# Altium schematic sheet ESP12.SchDoc: *ProgV1.2
size 400 x 200 mm; DrawnBy: *Ankul Baghel; SheetNumber: 1; SheetTotal: 1
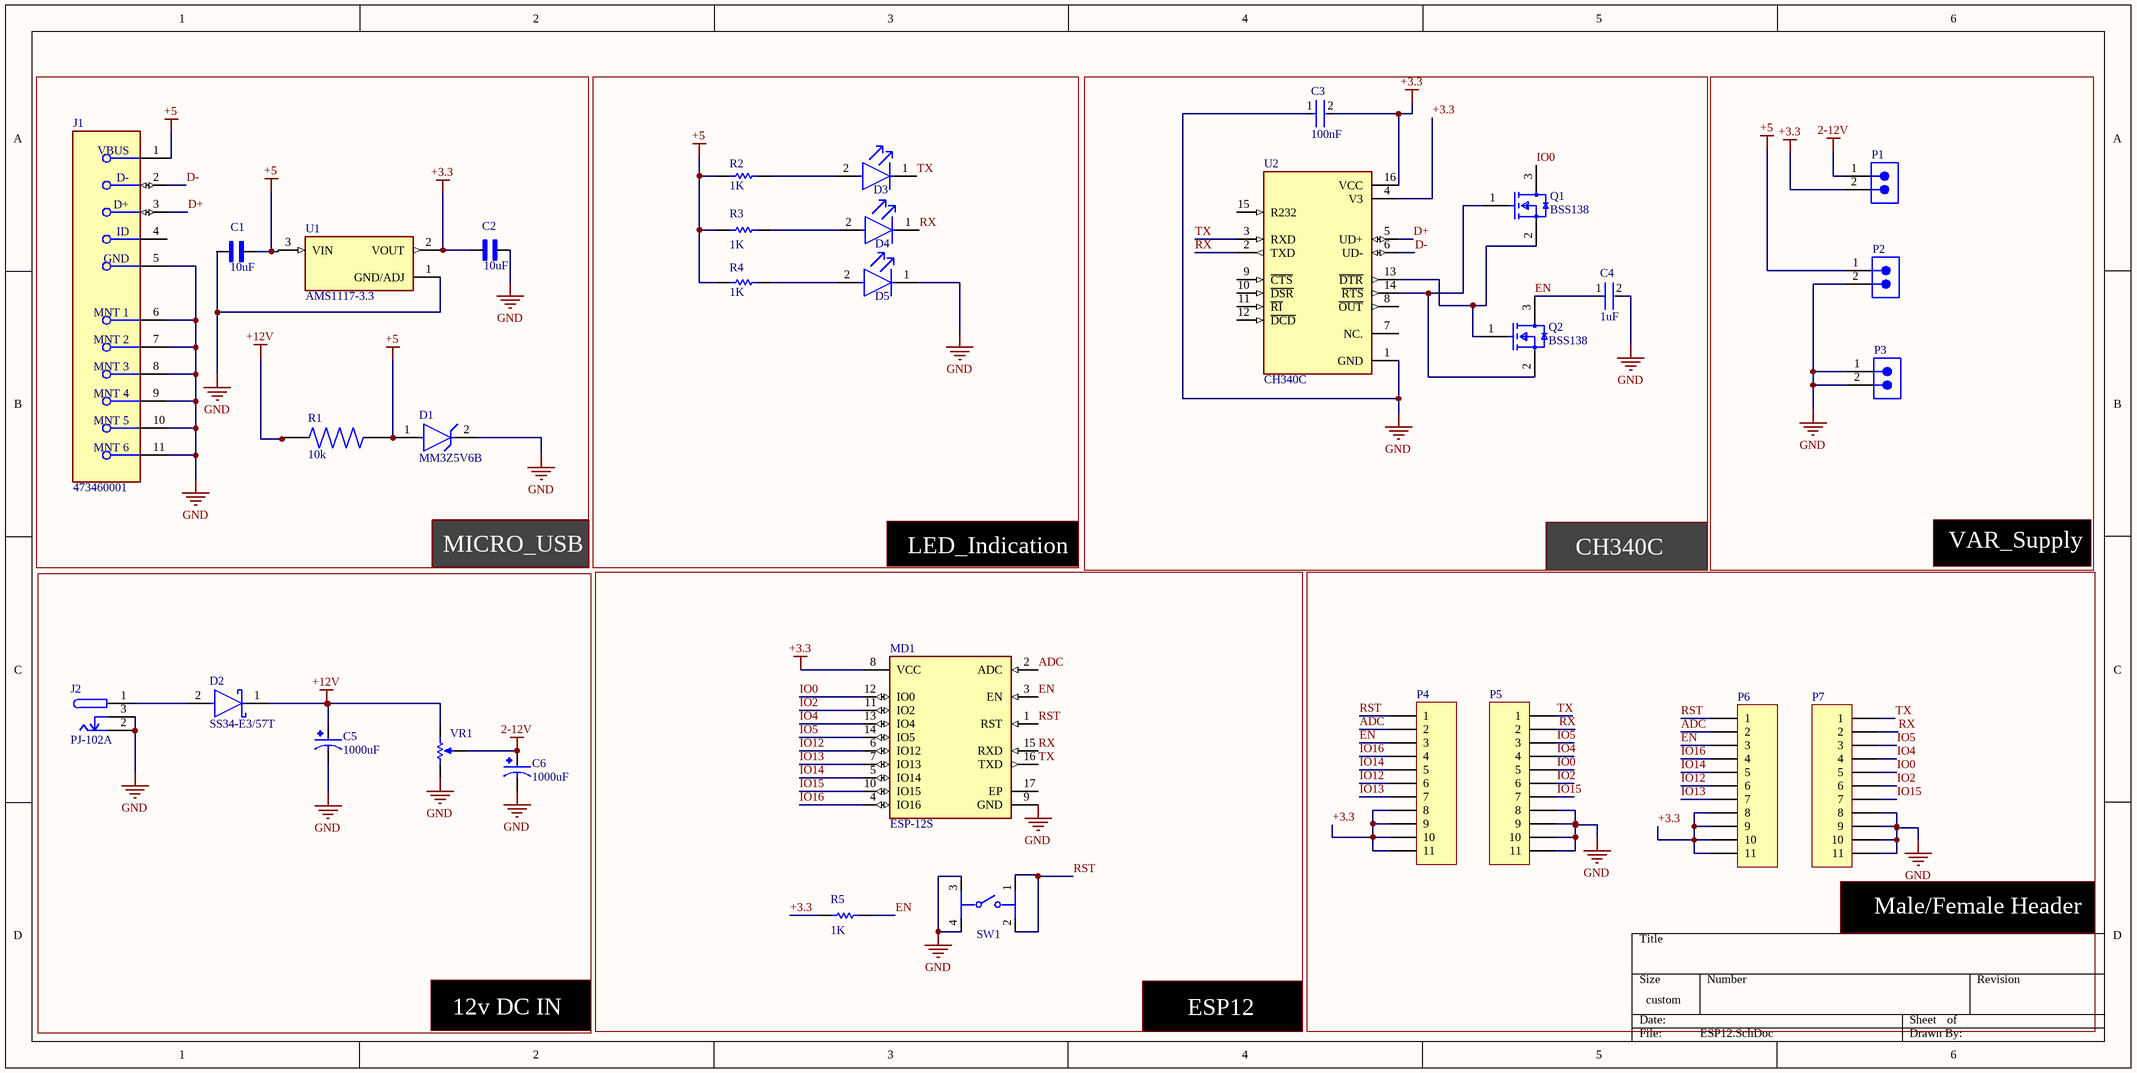
[diagram p0: ESP12.SchDoc]

## Parts
C1  10uF  [CAPC2012X145N]
C2  10uF  [CAPC2012X145N]
C3  100nF  [FP-CC0805-0_85-MFG]
C4  1uF  [FP-CC0805-0_85-MFG]
C5  1000uF  [CAPPRD500W60D1000H1600]
C6  1000uF  [CAPPRD500W60D1000H1600]
D1  MM3Z5V6B  [FP-MM3Z5V6B-MFG]
D2  SS34-E3/57T  [FP-95402-MFG]
D3  LTST-C190KRKT  [FP-LTST-C190KRKT-MFG]  (value not drawn)
D4  LTST-C190KGKT  [FP-LTST-C190KGKT-MFG]  (value not drawn)
D5  LTST-C190KRKT  [FP-LTST-C190KRKT-MFG]  (value not drawn)
J1  473460001  [FP-473460001-MFG]
J2  PJ-102A  [FP-PJ-102A-MFG]
MD1  ESP-12S  [FP-ESP-12S-MFG]
P1  61300211121  [61300211121]  (value not drawn)
P2  61300211121  [61300211121]  (value not drawn)
P3  61300211121  [61300211121]  (value not drawn)
P4  Header 11  [HDR1X11]  (value not drawn)
P5  Header 11  [HDR1X11]  (value not drawn)
P6  Header 11  [HDR1X11]  (value not drawn)
P7  Header 11  [HDR1X11]  (value not drawn)
Q1  BSS138  [FP-318-08-IPC_B]
Q2  BSS138  [FP-318-08-IPC_B]
R1  10k  [RESC2012X60N]
R2  1K  [RESC2013X60X35ML10T20]
R3  1K  [RESC2013X60X35ML10T20]
R4  1K  [RESC2013X60X35ML10T20]
R5  1K  [RESC2013X60X35ML10T20]
SW1  PTS645SM43SMTR92LFS  [PTS645SM43SMTR92LFS_MFG]  (value not drawn)
U1  AMS1117-3.3  [SOT229P700X180-4N]
U2  CH340C  [SOIC127P600X180-16N]
VR1  3362P-1-103LF  [BOUR-3362P]  (value not drawn)

## Blocks framed on the sheet
MICRO_USB: C1 C2 D1 J1 R1 U1
LED_Indication: D3-D5 R2-R4
CH340C: C3 C4 Q1 Q2 U2
VAR_Supply: P1-P3
ESP12: MD1 R5 SW1
Male/Female Header: P4-P7

## Nets
2-12V: C6.P P1.1 VR1.2(S)
+3.3: C2.1 C3.2 MD1.8(VCC) P1.2 P4.8 P4.9 P4.10 P4.11 P6.8 P6.9 P6.10 P6.11 R5.1 U1.2(VOUT) U2.4(V3) U2.16(VCC)
+5: C1.2 D1.1(A) J1.1(VBUS) P2.1 R1.2 R2.1 R3.1 R4.1 U1.3(VIN)
+12V: C5.P D2.1(C) R1.1 VR1.3(CW)
GND: C1.1 C2.2 C3.1 C4.2 C5.N C6.N D1.2(C) D5.1(C) J1.5(GND) J1.6(MNT_1) J1.7(MNT_2) J1.8(MNT_3) J1.9(MNT_4) J1.10(MNT_5) J1.11(MNT_6) J2.2 J2.3 MD1.9(GND) P2.2 P3.1 P3.2 P5.8 P5.9 P5.10 P5.11 P7.8 P7.9 P7.10 P7.11 SW1.3 SW1.4 U1.1(GND/ADJ) U2.1(GND) VR1.1(CCW)
ADC: MD1.2(ADC) P4.2 P6.2
D+: J1.3(D+) U2.5(UD+)
D-: J1.2(D-) U2.6(UD-)
EN: C4.1 MD1.3(EN) P4.3 P6.3 Q2.3(D) R5.2
IO0: MD1.12(IO0) P5.5 P7.5 Q1.3(D)
IO2: MD1.11(IO2) P5.6 P7.6
IO4: MD1.13(IO4) P5.4 P7.4
IO5: MD1.14(IO5) P5.3 P7.3
IO12: MD1.6(IO12) P4.6 P6.6
IO13: MD1.7(IO13) P4.7 P6.7
IO14: MD1.5(IO14) P4.5 P6.5
IO15: MD1.10(IO15) P5.7 P7.7
IO16: MD1.4(IO16) P4.4 P6.4
RST: MD1.1(RST) P4.1 P6.1 SW1.1 SW1.2
RX: D4.1(C) MD1.15(RXD) P5.2 P7.2 U2.2(TXD)
TX: D3.1(C) MD1.16(TXD) P5.1 P7.1 U2.3(RXD)
NetD2_2: D2.2(A) J2.1
NetD3_2: D3.2(A) R2.2
NetD4_2: D4.2(A) R3.2
NetD5_2: D5.2(A) R4.2
NetQ1_1: Q1.1(G) Q2.2(S) U2.14(~{RTS})
NetQ1_2: Q1.2(S) Q2.1(G) U2.13(~{DTR})

Not connected (* = marked no-connect by the designer): J1 4(ID); MD1 17(EP); U2 7(NC.) 8(~{OUT}) 9(~{CTS}) 10(~{DSR}) 11(~{RI}) 12(~{DCD}) 15(R232)

## Notes on the sheet
- 12v DC IN

## Library data of the parts
C1 C2 = CC0805KKX5R8BB106: 10 ÂµF Â±10% 25V Ceramic Capacitor X5R 0805 (2012 Metric); MF: Yageo; SnapEDA_Link: https://www.snapeda.com/parts/CC0805KKX5R8BB106/Yageo/view-part/?ref=snap; Package: 0805 Yageo; Value: *; MP: CC0805KKX5R8BB106; Check_prices: https://www.snapeda.com/parts/CC0805KKX5R8BB106/Yageo/view-part/?ref=eda
C3 = CMP-2100-03606-3: CAP CER 0.1UF 50V X7R 0805; Manufacturer Part Number: CC0805KRX7R9BB104; Manufacturer: Yageo; Tolerance: 0.1; Material: Ceramic; Device Class L1: Passive Components; ComponentLink2Description: Datasheet; Package: CC0805-0.85; Digikey Description: CAP CER 0.1UF 50V X7R 0805; Capacitance: 100 nF; Device Class L3: Ceramic Capacitors; Value: 100 nF; Temperature: -30°C to +85°C; Temperature Characteristic: X7R; Voltage Rating: 50 V; Height: 0.95mm; RoHS: TRUE; Ipc Land Pattern Name: CAPC200125X85; Device Class L2: Capacitors; Category: Cap; Temperature Range Low: -30°C; Temperature Range High: +85°C; Mouser Description: Multilayer Ceramic Capacitors MLCC - SMD/SMT 100nF 50V X7R 10%; Footprint Url: http://www.yageo.com/exep/pages/download/literatures/UPY-C_GEN_24.pdf; Automotive: No; Octopart: https://octopart.com/cc0805krx7r9bb104-yageo-192993; Lead Free: Yes; ComponentLink2URL: http://www.yageo.com/documents/recent/UPY-GPHC_Y5V_6.3V-to-50V_8.pdf
C4 = CMP-03422-000001-1: CAP CER 1UF 16V X7R 0805; Manufacturer: Yageo; Manufacturer Part Number: CC0805KKX7R7BB105; Material: Ceramic; Tolerance: 0.1; Voltage Rating: 16 V; Category: Cap; Capacitance: 1 uF; ComponentLink2Description: Datasheet; Automotive: No; Temperature Range High: +85°C; RoHS: TRUE; Footprint Url: http://www.yageo.com/exep/pages/download/literatures/UPY-C_GEN_24.pdf; Mouser Description: Multilayer Ceramic Capacitors MLCC - SMD/SMT 1.0uF 16V X7R 10%; Height: 0.95mm; Ipc Land Pattern Name: CAPC200125X85; Temperature: -30°C to +85°C; Lead Free: Yes; Value: 1 uF; Temperature Characteristic: X7R; Package: CC0805-0.85; Temperature Range Low: -30°C; Device Class L1: Passive Components; Device Class L3: Ceramic Capacitors; Octopart: https://octopart.com/cc0805kkx7r7bb105-yageo-8376555; ComponentLink2URL: http://www.yageo.com/documents/recent/UPY-GPHC_Y5V_6.3V-to-50V_8.pdf; Device Class L2: Capacitors; Digikey Description: CAP CER 1UF 16V X7R 0805
C5 C6 = EEUFR1C102B: CAP ALUM 1000UF 20% 16V RADIAL; MF: Panasonic; MP: EEU-FR1C102B; Value: *; Price: None; Package: RADIAL-2 Panasonic; SnapEDA_Link: https://www.snapeda.com/parts/EEU-FR1C102B/Panasonic/view-part/2318035/?ref=snap; Check_prices: https://www.snapeda.com/parts/EEU-FR1C102B/Panasonic/view-part/2318035/?ref=eda; Availability: In Stock; Purchase-URL: https://pricing.snapeda.com/search/part/EEU-FR1C102B/?ref=eda
D1 = CMP-07164-000010-1: DIODE ZENER 5.6V 200MW SOD323F; Manufacturer: ON Semiconductor; Reverse Voltage: 2V; Zener Impedance: 37Ω; Forward Current: 10mA; Max Junction Temp: +150°C; Max Zener Voltage: 5.71V; Max Reverse Leakage Current: 0.9uA; Digikey Description: DIODE ZENER 5.6V 200MW SOD323F; Temperature: to +150°C; Temperature Range High: +150°C; Device Class L1: Discrete Semiconductors; Power Dissipation: 200mW; Package: SOD323F; Category: Diode; RoHS: TRUE; Device Class L2: Diodes; Octopart: https://octopart.com/mm3z5v6b-on+semiconductor-84329898; Mouser Description: Zener Diodes Diode Zener 5.6V 200mW 2%; ComponentLink2URL: https://www.onsemi.com/pub/Collateral/MM3Z9V1B-D.pdf; Height: 1mm; Nom Zener Voltage: 5.6V; Manufacturer Part Number: MM3Z5V6B; Automotive: No; Lead Free: Yes; ComponentLink2Description: Datasheet; Device Class L3: Zener Diodes
D2 = CMP-02539-000012-1: DIODE SCHOTTKY 40V 3A DO214AB; Manufacturer: Vishay; Max Junction Temp: +150°C; Peak Reverse Current: 0.5mA; Max Surge Forward Current: 100A; Standoff Height: 0mm; ComponentLink2Description: Datasheet; Device Class L3: Schottky Diodes; Height: 2.62mm; Max Repetitive Reverse Voltage: 40V; Lead Free: Yes; Package: 95402; Temperature Range High: +150°C; ComponentLink2URL: http://www.vishay.com/docs/88751/ss32.pdf; Temperature: -55°C to +150°C; Footprint Url: http://www.vishay.com/docs/95402/smc.pdf; Automotive: No; Forward Current: 3A; Category: Diode; Manufacturer Part Number: SS34-E3/57T; RoHS: TRUE; Device Class L2: Diodes; Mouser Description: Schottky Diodes & Rectifiers 3.0 Amp 40 Volt; Octopart: https://octopart.com/ss34-e3%2F57t-vishay-39552907; Temperature Range Low: -55°C; Device Class L1: Discrete Semiconductors; Digikey Description: DIODE SCHOTTKY 40V 3A DO214AB
D3 D5 = CMP-1674-00011-2: LED RED CLEAR CHIP SMD; Reverse Voltage: 5V; Viewing Angle: 130°; Power Rating: 75mW; Test Current: 20mA; Number of Elements: 1; Lens Color: Colorless; Wavelength: 639nm; Dominant Wavelength: 631nm; Lens Style: Diffused; Forward Current: 30mA; Forward Voltage: 2.4V; Luminous Intensity: 54mcd; Color: Red; Case Code (Imperial): 0603; Lens Transparency: Clear; Lead Free: Lead Free; Package Quantity: 1; Packaging: Tape and Reel; Max Operating Temperature: 85°C; Number of Pins: 2; Height: 0.8mm; Case/Package: 0603; Number of LEDs: 1; Width: 0.8mm; Case Code (Metric): 1608; Depth: 0.8mm; Mount: Surface Mount; Radiation Hardening: No; Length: 1.6mm; Illumination Color: Red; Power Dissipation: 75mW; Min Operating Temperature: -55°C
D4 = CMP-2000-05197-2: LED GREEN CLEAR CHIP SMD; Test Current: 20mA; Power Rating: 75mW; Forward Voltage: 2V; Wavelength: 574nm; Number of LEDs: 1; Reverse Voltage: 5V; Dominant Wavelength: 571nm; Lens Style: Diffused; Luminous Intensity: 35mcd; Forward Current: 30mA; Viewing Angle: 130°; Lens Color: Colorless; Width: 0.8mm; Case Code (Imperial): 0603; Case Code (Metric): 1608; Number of Pins: 2; Radiation Hardening: No; Package Quantity: 1; Lead Free: Lead Free; Lens Transparency: Clear; Depth: 0.8mm; Power Dissipation: 75mW; Mount: Surface Mount; Max Operating Temperature: 85°C; Case/Package: 0603; Height: 0.8mm; Illumination Color: Green; Color: Green; Length: 1.6mm; Packaging: Tape and Reel; Number of Elements: 1; Min Operating Temperature: -55°C
J1 = CMP-2000-05246-2: CONN RCPT USB2.0 MICRO B SMD R/A; Manufacturer: Molex; Conn Orientation: Right Angle; Is Female: yes; Shielding: true; Pitch: 0.65mm; Number Of Contacts: 5; Voltage Rating: 30V; Current Rating: 1.8A; Device Class L2: USB Connectors; Digikey Description: CONN RCPT USB2.0 MICRO B SMD R/A; Height: 2.945mm; RoHS: TRUE; ComponentLink2Description: Datasheet; Octopart: https://octopart.com/47346-0001-molex-7164928; Automotive: No; Package: 0; Category: Conn; Device Class L1: Connectors; Usb Standard: USB 2.0; Temperature: -30°C to +85°C; Temperature Range Low: -30°C; Footprint Url: https://www.molex.com/pdm_docs/sd/473460001_sd.pdf; ComponentLink2URL: https://www.molex.com/webdocs/datasheets/pdf/en-us/0473460001_IO_CONNECTORS.pdf; Lead Free: Yes; Manufacturer Part Number: 473460001; Contact Material: Gold,Nickel; Temperature Range High: +85°C; Device Class L3: unset
J2 = CMP-12637-106234071-1: PJ-102A 2.0 x 6.5 mm, 2.5 A, Horizontal, Through Hole, Tapered Pins, Dc Power Jack Connector; Voltage Rating (DC): 24V; Number of Contacts: 3; Outside Diameter: 6.5mm; Gender: Male; Shielding: No; Insulation Resistance: 50MΩ; Current Rating: 2.5A; Inside Diameter: 2mm; Number of Conductors: 2; Housing Color: Black; RoHS: Compliant; Diameter: 2.1mm; Mount: Through Hole; Contact Plating: Nickel; NexarPartId: 106234071; Voltage Rating: 24V; Housing Material: Thermoplastic; Max Operating Temperature: 85°C; Color: Black; Contact Material: Copper, Nickel, Tin; Orientation: Horizontal; Packaging: Bulk; Flammability Rating: UL94 V-0; Schedule B: 8536695050, 8536695050; Contact Gender: Male; Lead Free: Lead Free; Termination: Through Hole; Min Operating Temperature: -25°C; Height: 11.2mm; Lifecycle Status: Production
MD1 = CMP-204316-000002-1: RX TXRX MOD WIFI PCB TRACE SMD; Interface: I2C; Sensitivity: -90dBm; Data Rate: 54Mbps; Frequency: 2.484GHz; Series: -
P1-P3 = CMP-1712-00002-7: THT Vertical Pin Header WR-PHD, Pitch 2.54 mm, Single Row, 2 pins; Pitch: 2.54mm; Number of Contacts: 2; Connector Type: Male Pin; Gender: Male; Contact Resistance: 20mΩ; Operating Supply Voltage: 250V; Current Rating: 3A; Housing Material: PBT; RoHS: Compliant; Lead Free: Lead Free; Contact Material: Gold; REACH SVHC: No; Min Operating Temperature: -40°C; Termination: Through Hole; Number of Pins: 2; Contact Gender: Male; Packaging: Bulk; Lead Pitch: 2.54mm; Contact Plating: Gold; Orientation: Vertical; Mount: Through Hole; Height: 8.94mm; Color: Black; Number of Positions: 2; Contact Mating Length: 5.9944mm; Max Operating Temperature: 105°C; Voltage Rating: 250V; Number of Rows: 1
P4-P7 = Header 11: Header, 11-Pin; LatestRevisionDate: 17-Jul-2002; LatestRevisionNote: Re-released for DXP Platform.; Publisher: Altium Limited
Q1 Q2 = CMP-07173-000101-1: MOSFET N-CH 50V 220MA SOT-23; Turn-Off Delay Time: 20ns; Element Configuration: Single; Rds On Max: 3.5R; Gate to Source Voltage (Vgs): 20V; Threshold Voltage: 1.3V; Number of Elements: 1; Power Dissipation: 360mW; Rise Time: 9ns; Turn-On Delay Time: 2.5ns; Input Capacitance: 27pF; On-State Resistance: 6R; Lead Free: Lead Free; Length: 2.92mm; Width: 1.3mm; Drain to Source Breakdown Voltage: 50V; Min Operating Temperature: -55°C; REACH SVHC: No SVHC; Packaging: Tape and Reel; Radiation Hardening: No; Height: 0.93mm; Drain to Source Voltage (Vdss): 50V; Current Rating: 220mA; Voltage Rating (DC): 50V; Weight: 0.03g; Continuous Drain Current (ID): 220mA; Number of Pins: 3; Nominal Vgs: 1.3V; Max Power Dissipation: 360mW; Fall Time: 9ns; Drain to Source Resistance: 3.5R; Contact Plating: Tin; Case/Package: SOT-23; Package Quantity: 1; Dual Supply Voltage: 50V; Mount: Surface Mount; Termination: SMD/SMT; Max Operating Temperature: 150°C
R1 = RC0805JR-0710KL: RESISTOR THICK FILM 5% 0.125W; MF: {'manufacturer': u'YAGEO'}; Package: None; Price: None; Value: *; MP: RC0805JR-0710KL; Availability: Unavailable
R2-R5 = CMP-2100-03671-1: Chip Resistor, 1 KOhm, +/- 1%, 125 mW, -55 to 155 degC, 0805 (2012 Metric), RoHS, Tape and Reel; Manufacturer: Yageo; Temperature Coefficient: 100ppm/degreesC; Voltage Rating (DC): 150V; Max Power Dissipation: 125mW; Resistance: 1KOhm; Number of Pins: 2; Number of Terminations: 2; Datasheet URL: http://www.yageo.com/NewPortal/yageodocoutput?fileName=/pdf/R-Chip/PYu-RC_Group_51_RoHS_L_5.pdf; Length: 0.079inch; Package Description: 2-Pin Surface Mounted Device, Body 2 x 1.25 mm; Depth: 1.25mm; Height: 0.024inch; Military Standard: Not; Case/Package: 0805; Package Reference: 0805; RoHSCompliant: true; Lead Free: LeadFree; Packaging: TapeandReel; Package Quantity: 1; Datasheet Version: Rev. 5, 10/2016; Tolerance: 1%; Min Operating Temperature: -55degC; Voltage Rating: 150V; Composition: ThickFilm; Case Code (Imperial): 0805; Power Rating: 125mW; Width: 0.049inch; Case Code (Metric): 2012; Manufacturer URL: http://www.yageo.com/; Max Operating Temperature: 155degC; REACH SVHC: Unknown; Termination: SMD/SMT
SW1 = CMP-2000-05160-3: Switch Tactile N.O SPST Round Button Gull Wing 0.05A 12VDC 100000Cycle 1.57N SMD T/R; Switch Function: Off-Mom; Life (Cycles): 100kcycles; Voltage Rating (DC): 12V; Actuator Material: Nylon, Polyamide; Max Current Rating: 50mA; Contact Resistance: 100mΩ; Number of Positions: 1; Actuator Length: 850µm; Illumination Type: Illuminated, Non-Illuminated; Insulation Resistance: 100GΩ; RoHS: Compliant; Electrical Life: 100kcycles; Lead Free: Lead Free; Contact Plating: Silver; Case/Package: SMD/SMT; Termination: Solder; Height: 3.45mm; Manufacturer Package Identifier: PTS645SM43SMTR92LFS; ComponentLink1URL: http://www.ck-components.com/; Max Voltage Rating (DC): 12V; Lifecycle Status: Production; Min Operating Temperature: -20°C; Throw Configuration: SPST; China RoHS: Compliant; ComponentLink1Description: Manufacturer's Website; Operating Force: 1.57N; Depth: 9mm; Contact Material: Silver; Length: 6mm; Current Rating: 50mA; Color: Black; Contact Current Rating: 50mA; Mechanical Life: 100kcycles; ComponentLink2URL: https://www.ckswitches.com/media/1471/pts645.pdf; Orientation: Straight; Packaging: Cut Tape (CT); REACH SVHC: Yes; Max Operating Temperature: 60°C; ComponentLink2Description: Datasheet URL; HelpURL: https://www.ckswitches.com/media/1471/pts645.pdf; Mount: Surface Mount
U1 = AMS1117-3.3: Sot223/Pkg 1-Amp 3.3-Volt Low Drop Out Voltage Regulatator; MF: Advanced Monolithic Systems; SnapEDA_Link: https://www.snapeda.com/parts/AMS1117-3.3/Advanced+Monolithic+Systems/view-part/?ref=snap; Package: SOT-223 Seeed Technology; Value: *; MP: AMS1117-3.3; Check_prices: https://www.snapeda.com/parts/AMS1117-3.3/Advanced+Monolithic+Systems/view-part/?ref=eda
U2 = CH340C: USB to serial chip CH340; MF: WCH; Price: None; Availability: Not in stock; MP: CH340C; Package: None; SnapEDA_Link: https://www.snapeda.com/parts/CH340C/WCH/view-part/?ref=snap; Check_prices: https://www.snapeda.com/parts/CH340C/WCH/view-part/?ref=eda; Value: *
VR1 = CMP-1747-00004-1: Square Trimpot(R) Trimming Potentiometer, 10 KOhm, 300 V, -55 to 125 degC, 3-Pin THD, RoHS, Tube; Voltage Rating: 220 mV; Power Rating: 1 W; Tolerance: 1%; Resistance: 50 mohm; Case/Package: 1206; Length: 3.2 mm; RoHSCompliant: True; PackageDescription: 3-Pin Through Hole Device, Body 6.6 x 6.99 mm, Pitch 2.54 mm; ComponentLink2Description: Datasheet; REACH SVHC: No SVHC; Mount: Surface Mount; Height: 0.6 mm; Packaging: Tape and Reel; ComponentLink1URL: http://www.bourns.com/; Case Code (Imperial): 0612; Pins: 2; Case Code (Metric): 1632; ComponentLink2URL: http://www.bourns.com/docs/Product-Datasheets/3362.pdf; Min Operating Temperature: -25degC; ComponentLink1Description: Manufacturer URL; PackageReference: 3326P; Max Operating Temperature: 125degC; Width: 1.6 mm; Package Quantity: 5000; DatasheetVersion: May-16